# EasyEDA Pro project InOut Counter - Copy.eprj

# Schematic MainBoard
Board Name: PCB2; Create Date: 2026-01-17; Page Name: P1; Project Name: InOut Counter - Copy; Schematic Name: MainBoard; Update Date: 2026-01-24; Company: EasyEDA.com; Page Size: A4; Version: V1.0
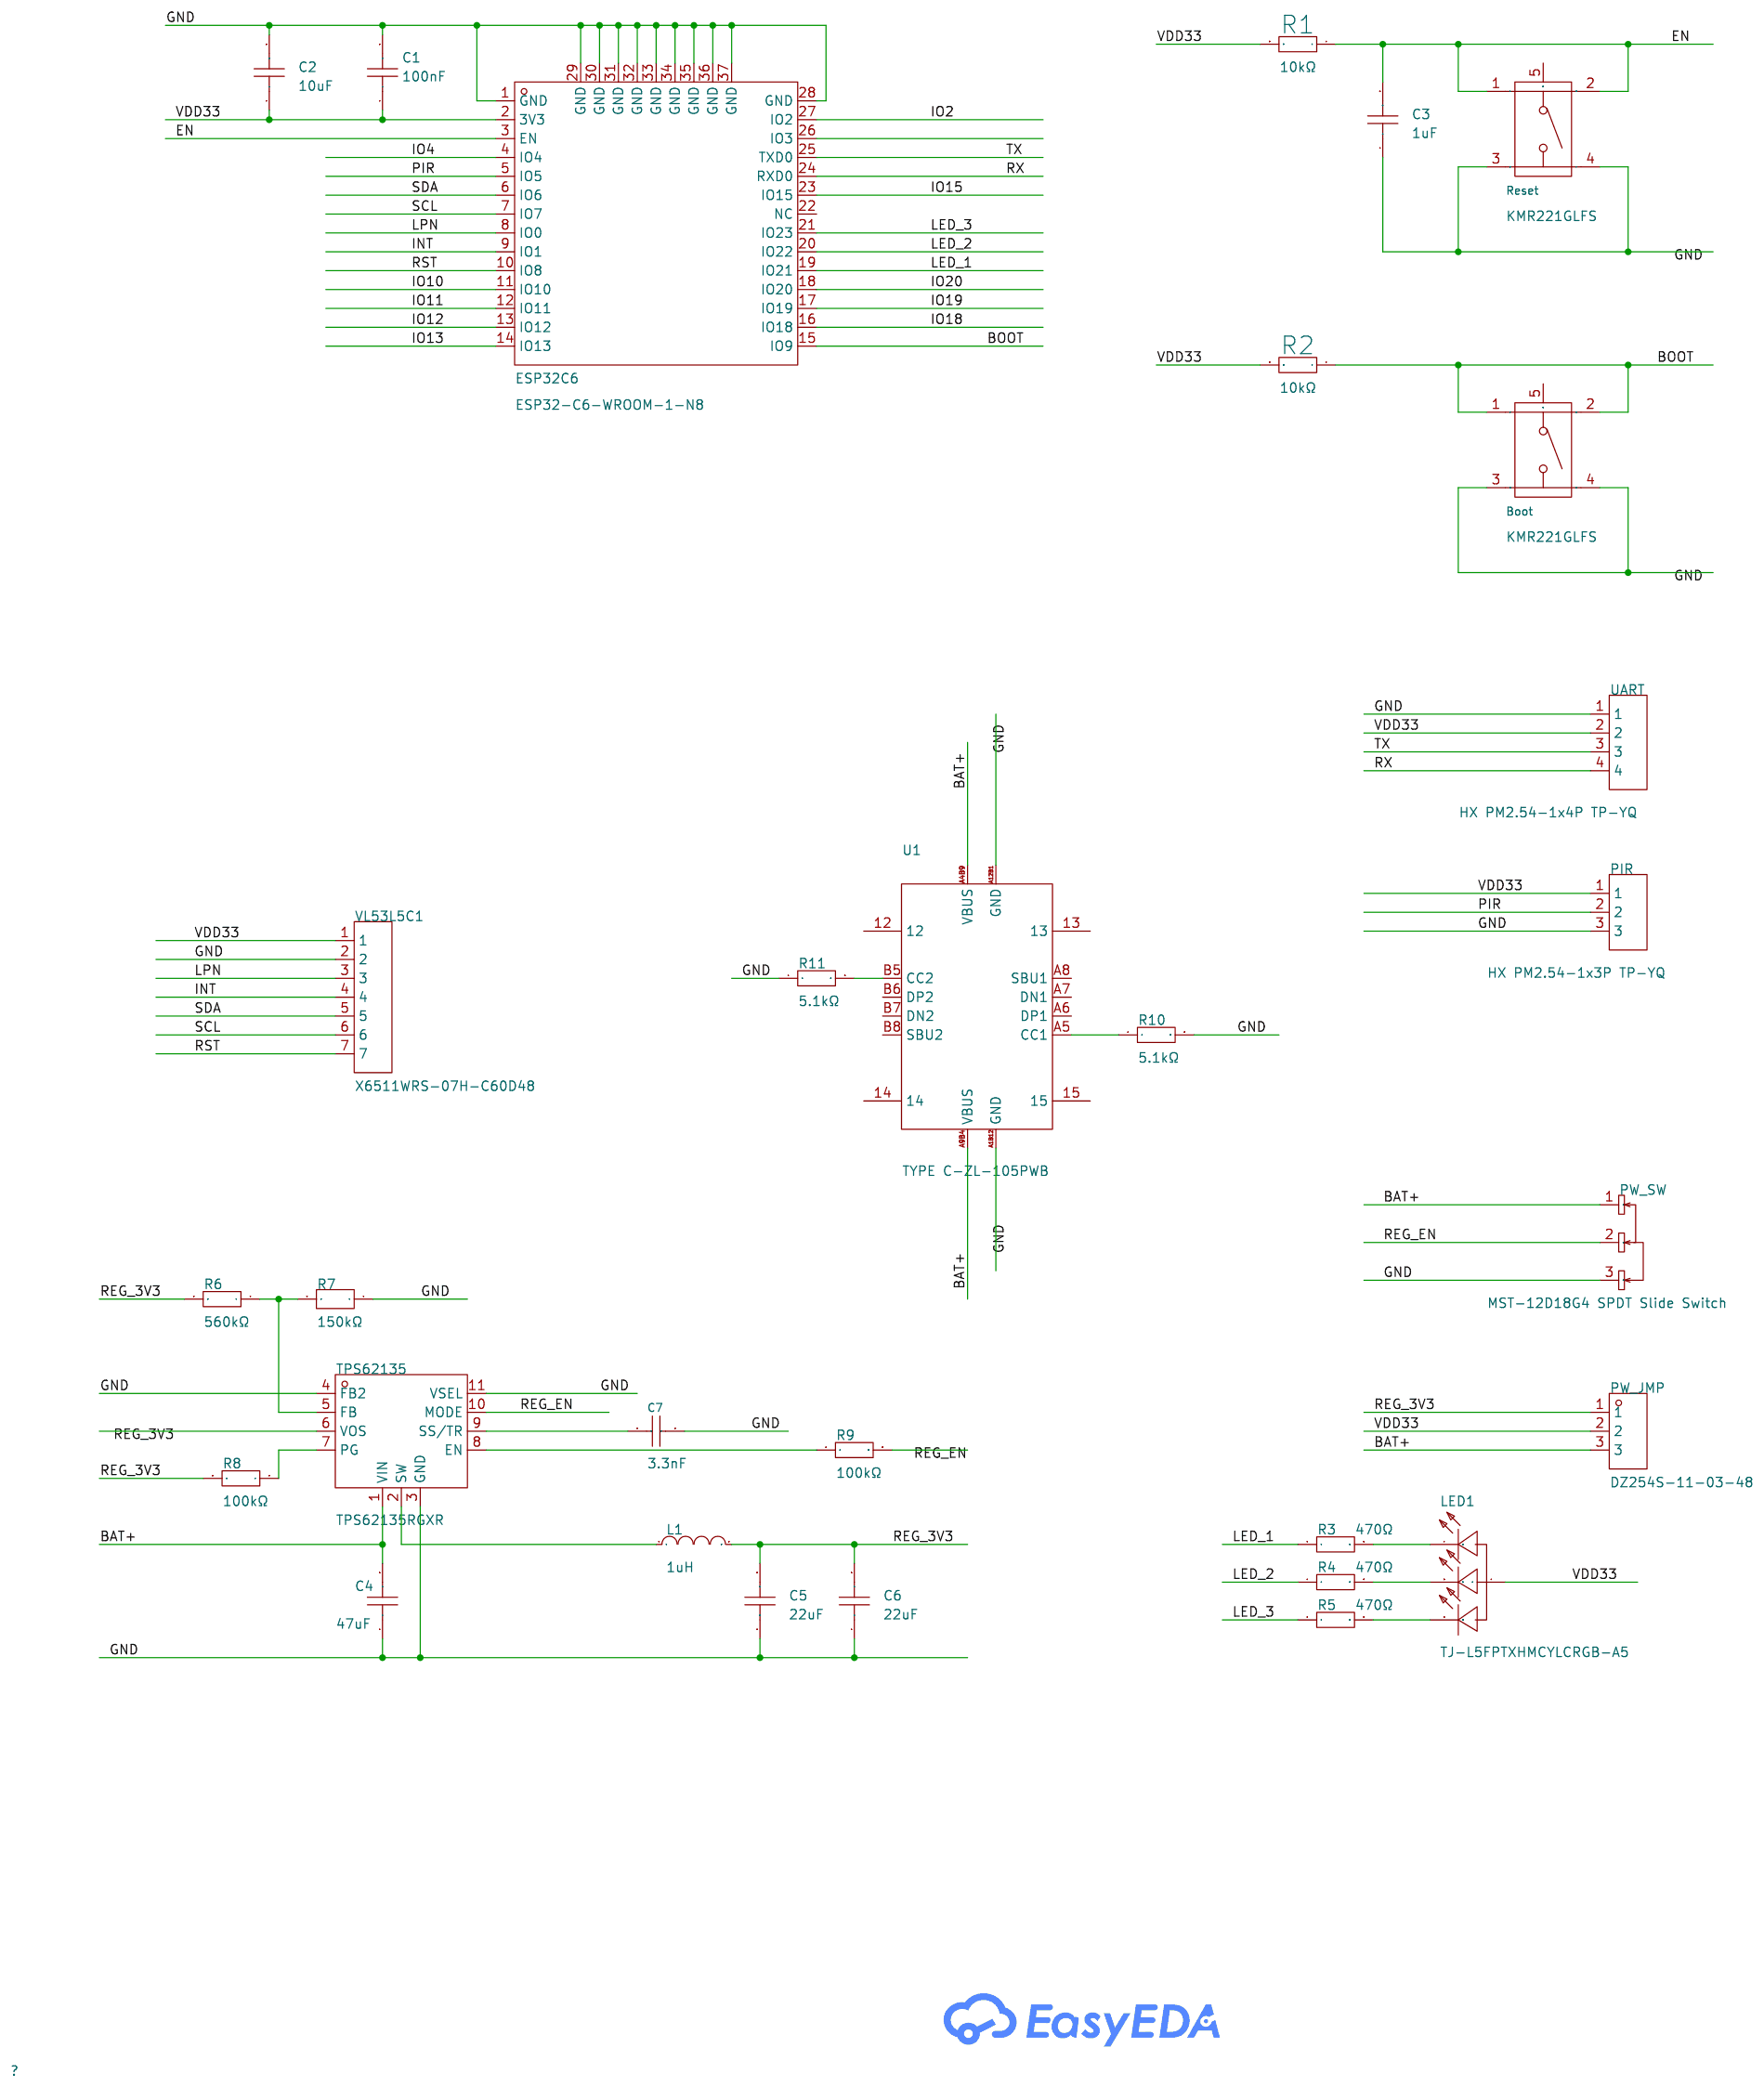
[diagram p0: schematic sheet]

## Parts
Boot  KMR221GLFS  [KEY-SMD_KMR2XXGXXX]
C1  100nF  [C0603]
C2  10uF  [C0603]
C3  1uF  [C0603]
C4  47uF  [C1206]
C5  22uF  [C0603]
C6  22uF  [C0603]
C7  3.3nF  [C0603]
ESP32C6  ESP32-C6-WROOM-1-N8  [WIRELM-SMD_ESP32-C6-WROOM-1]
L1  1uH  [IND-SMD_L2.5-W2.0-VLS252012CX-150M]
LED1  TJ-L5FPTXHMCYLCRGB-A5  [LED-TH_4P-BD5.8-P1.30]
PIR  HX PM2.54-1x3P TP-YQ  [HDR-SMD_3P-P2.54-V-F_C9900045551]
PW_JMP  DZ254S-11-03-48  [HDR-TH_3P-P2.54_DZ254S-11-03-48]
PW_SW  MST-12D18G4 SPDT Slide Switch  [SW-SMD_MST-12D18G4-SPDT-SLIDE-SWITCH]
R1  10kΩ  [R0603]
R2  10kΩ  [R0603]
R3  470Ω  [R0603]
R4  470Ω  [R0603]
R5  470Ω  [R0603]
R6  560kΩ  [R0603]
R7  150kΩ  [R0603]
R8  100kΩ  [R0603]
R9  100kΩ  [R0603]
R10  5.1kΩ  [R0603]
R11  5.1kΩ  [R0603]
Reset  KMR221GLFS  [KEY-SMD_KMR2XXGXXX]
TPS62135  TPS62135RGXR  [VQFN-HR-11_L3.0-W2.0-P0.50_TPS62135RGXR]
U1  TYPE C-ZL-105PWB  [TYPE-C-SMD_HDGC_TYPE-C-ZL-105PWB]
UART  HX PM2.54-1x4P TP-YQ  [HDR-SMD_HX-PM2.54-1X4P-TP-YQ]
VL53L5C1  X6511WRS-07H-C60D48  [HDR-SMD_7P-P2.54-H-M-W13.3-N]

## Library data of the parts
Boot Reset = KMR221GLFS: LCSC Part Name: 4.6*2.8*1.9mm 立贴 轻触开关; Supplier Part: C72443; Manufacturer: C&K; Supplier Footprint: SMD; JLCPCB Part Class: Extended Part; Datasheet: https://atta.szlcsc.com/upload/public/pdf/source/20181012/C265019_000848423B8E84768868498C37CC451B.pdf; Supplier: LCSC; Circuit: SPST; Actuator Style: Round Button; Operating Force: 200gf; Mounting Style: Brick nogging; Switch Length: 4.6mm; Switch Width: 2.8mm; Switch Height: 1.9mm; Contact Current: 50mA; Voltage Rating (DC): 32V; Pin Style: Gull Wing; Operating Temperature: -40℃~+85℃
C1 = TCC0603X7R104K500CT: LCSC Part Name: 100nF ±10% 50V; Supplier Part: C282519; Manufacturer: CCTC(三环); Supplier Footprint: 0603; JLCPCB Part Class: Extended Part; Datasheet: https://item.szlcsc.com/datasheet/TCC0603X7R104K500CT/268639.html; Supplier: LCSC; Tolerance: ±10%; Voltage Rating: 50V; Temperature Coefficient: X7R
C2 = CL10A106MQ8NNNC: LCSC Part Name: 10uF ±20% 6.3V; Supplier Part: C1691; Manufacturer: SAMSUNG(三星); Supplier Footprint: 0603; JLCPCB Part Class: Extended Part; Datasheet: https://item.szlcsc.com/datasheet/CL10A106MQ8NNNC/2043.html; Supplier: LCSC; Tolerance: ±20%; Voltage Rating: 6.3V; Temperature Coefficient: X5R
C3 = CGA0603X5R105K500JT: LCSC Part Name: 1uF ±10% 50V; Supplier Part: C6119852; Manufacturer: HRE(芯声); Supplier Footprint: 0603; JLCPCB Part Class: Extended Part; Datasheet: https://item.szlcsc.com/datasheet/CGA0603X5R105K500JT/7062558.html; Supplier: LCSC; Tolerance: ±10%; Voltage Rating: 50V; Temperature Coefficient: X5R
C4 = GRM31CR61E476ME44L: LCSC Part Name: 47uF ±20% 25V; Supplier Part: C403725; Manufacturer: muRata(村田); Supplier Footprint: 1206; JLCPCB Part Class: Extended Part; Datasheet: https://item.szlcsc.com/datasheet/GRM31CR61E476ME44L/389810.html; Supplier: LCSC; Tolerance: ±20%; Voltage Rating: 25V; Temperature Coefficient: X5R
C5 C6 = CL10A226MQ8NRNC: LCSC Part Name: 22uF ±20% 6.3V; Supplier Part: C59461; Manufacturer: SAMSUNG(三星); Supplier Footprint: 0603; JLCPCB Part Class: Basic Part; Datasheet: https://item.szlcsc.com/datasheet/CL10A226MQ8NRNC/60514.html; Supplier: LCSC; Tolerance: ±20%; Voltage Rating: 6.3V; Temperature Coefficient: X5R
C7 = CC0603KRX7R9BB332: LCSC Part Name: 3.3nF ±10% 50V; Supplier Part: C107088; Manufacturer: YAGEO(国巨); Supplier Footprint: 0603; JLCPCB Part Class: Extended Part; Datasheet: https://item.szlcsc.com/datasheet/CC0603KRX7R9BB332/108304.html; Supplier: LCSC; Tolerance: ±10%; Voltage Rating: 50V; Temperature Coefficient: X7R
ESP32C6 = ESP32-C6-WROOM-1-N8: Supplier Part: C5366877; Manufacturer: ESPRESSIF(乐鑫); JLCPCB Part Class: Extended Part; Datasheet: https://item.szlcsc.com/datasheet/ESP32-C6-WROOM-1-N8/6203223.html; Supplier: LCSC
L1 = VLS252012HBX-1R0M-1: LCSC Part Name: 1uH ±20% 3A; Supplier Part: C360732; Manufacturer: TDK; Supplier Footprint: 1008; JLCPCB Part Class: Extended Part; Datasheet: https://item.szlcsc.com/datasheet/VLS252012HBX-1R0M-1/335519.html; Supplier: LCSC; Tolerance: ±20%; Current Rating: 3A; Current - Saturation(Isat): 3A; DC Resistance(DCR): 47mΩ
LED1 = TJ-L5FPTXHMCYLCRGB-A5: Diode Configuration:Common Anode Wavelength - Dominant:B:460nm~470nm；G:515nm~530nm；R:620nm~630nm Peak Wavelength:R:620nm；G:520nm；B:465nm Luminous Intensity:R:100mcd~200mcd；B:100mcd~200mcd；G:400mcd~600mcd Lens Color:White Frosted Lens Forward Current:20mA; LCSC Part Name: 5MM平头共阳雾状RGB; Supplier Part: C20613339; Manufacturer: TOGIALED(统佳); Supplier Footprint: 插件; JLCPCB Part Class: Extended Part; Datasheet: https://item.szlcsc.com/datasheet/TJ-L5FPTXHMCYLCRGB-A5/21974274.html; Supplier: LCSC; Diode Configuration: Common Anode; Wavelength - Dominant: B:460nm~470nm；G:515nm~530nm；R:620nm~630nm; Peak Wavelength: R:620nm；G:520nm；B:465nm; Luminous Intensity: R:100mcd~200mcd；B:100mcd~200mcd；G:400mcd~600mcd; Lens Color: White Frosted Lens; Forward Current: 20mA; Forward Voltage(Vf): B:2.8V~3.6V；R:1.8V~2.6V；G:2.8V~3.6V; Power(Watts): 184mW; Operating Temperature: -20℃~+80℃; Lamp Holder Type: 5 mm flat-head LED; Pitch: 1.3mm
PIR = HX PM2.54-1x3P TP-YQ: LCSC Part Name: 1x3P 间距:2.54mm 立贴; Supplier Part: C42379196; Manufacturer: hanxia(韩下); Supplier Footprint: SMD,P=2.54mm(交错脚); JLCPCB Part Class: Extended Part; Datasheet: https://item.szlcsc.com/datasheet/HX%2520PM2.54-1x3P%2520TP-YQ/44285225.html; Supplier: LCSC; Holes Structure: 1x3P; Pitch: 2.54mm; Circular Hole / Square Hole: Square Hole; Mounting Type: Surface Mount,Vertical; Number of Rows: 1; Number of Positions: 3P; Current Rating: 3A; Voltage Rating (Max): 1kV; Holes Direction: Top; Insulation Height: 5mm; Contact Material: Brass; Contact Plating: Gold; Operating Temperature: -40℃~+105℃
PW_JMP = DZ254S-11-03-48: LCSC Part Name: 1x3P 间距:2.54mm 方针 立贴; Supplier Part: C5160786; Manufacturer: DEALON(德艺隆); Supplier Footprint: SMD,P=2.54mm(交错脚); JLCPCB Part Class: Extended Part; Datasheet: https://item.szlcsc.com/datasheet/DZ254S-11-03-48/5807882.html; Supplier: LCSC; Pin Structure: 1x3P; Pitch: 2.54mm; Circluar Pins/Square Pins: Pin Header; Mounting Type: Surface Mount,Vertical; Number of Rows: 1; Number of Pins: 3P; Current Rating: 3A; Length of Mating Pin: 6mm; Insulation Height: 2.54mm; Contact Material: Brass; Contact Plating: Gold; Color: Black
PW_SW = MST-12D18G4 SPDT Slide Switch: LCSC Part Name: MST-12D18G4卧式带柱编带; Supplier Part: C49023767; Manufacturer: SHOU HAN(首韩); Supplier Footprint: SMD; JLCPCB Part Class: Extended Part; Datasheet: https://item.szlcsc.com/datasheet/MST-12D18G4%2520SPDT%2520Slide%2520Switch/51384142.html; Supplier: LCSC; Circuit: SPDT; Actuator Style: Rectangular Columnar; Termination Style: SMD(SMT) Tab; Length: 9.1mm; Width: 3.5mm; Switch Height: 7.5mm; Mounting Type: Surface Mount, Right Angle; Actuator Color: Black; Current Rating: 100mA; Voltage Rating: 12V; Life: 10,000 Cycles; Operating Temperature: -25℃~+70℃
R1 R2 = 0603WAF1002T5E: LCSC Part Name: 厚膜电阻 10kΩ ±1% 100mW; Supplier Part: C25804; Manufacturer: UNI-ROYAL(厚声); Supplier Footprint: 0603; JLCPCB Part Class: Basic Part; Datasheet: https://item.szlcsc.com/datasheet/0603WAF1002T5E/26547.html; Supplier: LCSC; Type: Thick Film Resistor; Tolerance: ±1%; Power(Watts): 100mW; Voltage-Supply(Max): 75V; Temperature Coefficient: ±100ppm/℃; Operating Temperature: -55℃~+155℃
R3-R5 = 0603WAF4700T5E: LCSC Part Name: 470Ω ±1% 100mW 厚膜电阻; Supplier Part: C23179; Manufacturer: UNI-ROYAL(厚声); Supplier Footprint: 0603; JLCPCB Part Class: Basic Part; Datasheet: https://item.szlcsc.com/datasheet/0603WAF4700T5E/23906.html; Supplier: LCSC; Type: Thick Film Resistor; Tolerance: ±1%; Power(Watts): 100mW; Voltage-Supply(Max): 75V; Temperature Coefficient: ±100ppm/℃; Operating Temperature: -55℃~+155℃
R6 = 0603WAF5603T5E: LCSC Part Name: 560kΩ ±1% 100mW 厚膜电阻; Supplier Part: C23203; Manufacturer: UNI-ROYAL(厚声); Supplier Footprint: 0603; JLCPCB Part Class: Extended Part; Datasheet: https://item.szlcsc.com/datasheet/0603WAF5603T5E/23930.html; Supplier: LCSC; Type: Thick Film Resistor; Tolerance: ±1%; Power(Watts): 100mW; Voltage-Supply(Max): 75V; Temperature Coefficient: ±100ppm/℃; Operating Temperature: -55℃~+155℃
R7 = FRC0603F1503TS: LCSC Part Name: 150kΩ ±1% 100mW 厚膜电阻; Supplier Part: C2906993; Manufacturer: FOJAN(富捷); Supplier Footprint: 0603; JLCPCB Part Class: Extended Part; Supplier: LCSC; Type: Thick Film Resistor; Tolerance: ±1%; Power(Watts): 100mW; Voltage-Supply(Max): 75V; Temperature Coefficient: ±100ppm/℃; Operating Temperature: -55℃~+155℃
R8 R9 = 0603WAF1003T5E: LCSC Part Name: 100kΩ ±1% 100mW 厚膜电阻; Supplier Part: C25803; Manufacturer: UNI-ROYAL(厚声); Supplier Footprint: 0603; JLCPCB Part Class: Basic Part; Datasheet: https://item.szlcsc.com/datasheet/0603WAF1003T5E/26546.html; Supplier: LCSC; Type: Thick Film Resistor; Tolerance: ±1%; Power(Watts): 100mW; Voltage-Supply(Max): 75V; Temperature Coefficient: ±100ppm/℃; Operating Temperature: -55℃~+155℃
R10 R11 = 0603WAF5101T5E: LCSC Part Name: 5.1kΩ ±1% 100mW 厚膜电阻; Supplier Part: C23186; Manufacturer: UNI-ROYAL(厚声); Supplier Footprint: 0603; JLCPCB Part Class: Basic Part; Datasheet: https://item.szlcsc.com/datasheet/0603WAF5101T5E/23913.html; Supplier: LCSC; Type: Thick Film Resistor; Tolerance: ±1%; Power(Watts): 100mW; Voltage-Supply(Max): 75V; Temperature Coefficient: ±100ppm/℃; Operating Temperature: -55℃~+155℃
TPS62135 = TPS62135RGXR: LCSC Part Name: 高精度3V至17V 4A降压转换器; Supplier Part: C167238; Manufacturer: TI(德州仪器); Supplier Footprint: VQFN-11-HR(2x3); JLCPCB Part Class: Extended Part; Datasheet: https://www.ti.com/cn/lit/gpn/tps62135; Supplier: LCSC; Function: Step-down type; Output Type: Adjustable; Input Voltage: 3V~17V; Output Voltage: 800mV~12V; Output Current: 4A; Switching Frequency: 2.5MHz; Operating Temperature: -40℃~+125℃; Synchronous Rectification: Yes; Number of Outputs: 1; Topology: Step-down; Quiescent Current (Iq): 18uA; Switch tube (built-in/external): Built-in
U1 = TYPE C-ZL-105PWB: LCSC Part Name: Type-C 母 卧贴; Supplier Part: C5273953; Manufacturer: HDGC(华德共创); Supplier Footprint: SMD; JLCPCB Part Class: Extended Part; Datasheet: https://item.szlcsc.com/datasheet/TYPE%2520C-ZL-105PWB/6003804.html; Supplier: LCSC; Connector Type: Type-C; Gender: Female; Mounting Type: Surface Mount, Right Angle; Number of Contacts: 16P; Number of Ports: 1; Connect-Disconnect Life: 10,000 cycles; Length: 7.35mm
UART = HX PM2.54-1x4P TP-YQ: LCSC Part Name: 1x4P 间距:2.54mm 立贴; Supplier Part: C42379197; Manufacturer: hanxia(韩下); Supplier Footprint: SMD,P=2.54mm(交错脚); JLCPCB Part Class: Extended Part; Datasheet: https://item.szlcsc.com/datasheet/HX%2520PM2.54-1x4P%2520TP-YQ/44285226.html; Supplier: LCSC; Holes Structure: 1x4P; Pitch: 2.54mm; Circular Hole / Square Hole: Square Hole; Mounting Type: Surface Mount,Vertical; Number of Rows: 1; Number of Positions: 4P; Current Rating: 3A; Voltage Rating (Max): 1kV; Holes Direction: Top; Insulation Height: 5mm; Contact Material: Brass; Contact Plating: Gold; Operating Temperature: -40℃~+105℃
VL53L5C1 = X6511WRS-07H-C60D48: LCSC Part Name: 1x7P 间距:2.54mm 方针; Supplier Part: C5242200; Manufacturer: XKB Connection(中国星坤); Supplier Footprint: SMD,P=2.54mm; JLCPCB Part Class: Extended Part; Datasheet: https://atta.szlcsc.com/upload/public/pdf/source/20221103/EADF72CF36CD96D511D8188ACEE72315.pdf; Supplier: LCSC; Pin Structure: 1x7P; Pitch: 2.54mm; Row Spacing: 2.54mm; Circluar Pins/Square Pins: Policy; Number of Rows: Single Row; Number of Pins: 7P; Current Rating: 3A; Voltage Rating (Max): 250V; Insulation Height: 2.5mm; Contact Material: Brass; Contact Plating: Gold; Operating Temperature: -40℃~+105℃; Color: Black

## Nets
GND: Boot.3 Boot.4 C1.2 C2.2 C3.1 C4.1 C5.1 C6.1 C7.2 ESP32C6.1(GND) ESP32C6.28(GND) ESP32C6.29(GND) ESP32C6.30(GND) ESP32C6.31(GND) ESP32C6.32(GND) ESP32C6.33(GND) ESP32C6.34(GND) ESP32C6.35(GND) ESP32C6.36(GND) ESP32C6.37(GND) PIR.3 PW_SW.3 R7.1 R10.2 R11.1 Reset.3 Reset.4 TPS62135.3(GND) TPS62135.4(FB2) TPS62135.11(VSEL) U1.A1B12(GND) U1.A12B1(GND) UART.1 VL53L5C1.2
VDD33: C1.1 C2.1 ESP32C6.2(3V3) LED1.1 PIR.1 PW_JMP.2 R1.2 R2.2 UART.2 VL53L5C1.1
BAT+: C4.2 PW_JMP.3 PW_SW.1 TPS62135.1(VIN) U1.A4B9(VBUS) U1.A9B4(VBUS)
BOOT: Boot.1 Boot.2 ESP32C6.15(IO9) R2.1
EN: C3.2 ESP32C6.3(EN) R1.1 Reset.1 Reset.2
INT: ESP32C6.9(IO1) VL53L5C1.4
IO2: ESP32C6.27(IO2)
IO4: ESP32C6.4(IO4)
IO10: ESP32C6.11(IO10)
IO11: ESP32C6.12(IO11)
IO12: ESP32C6.13(IO12)
IO13: ESP32C6.14(IO13)
IO15: ESP32C6.23(IO15)
IO18: ESP32C6.16(IO18)
IO19: ESP32C6.17(IO19)
IO20: ESP32C6.18(IO20)
LED_1: ESP32C6.19(IO21) R3.1
LED_2: ESP32C6.20(IO22) R4.1
LED_3: ESP32C6.21(IO23) R5.1
LPN: ESP32C6.8(IO0) VL53L5C1.3
PIR: ESP32C6.5(IO5) PIR.2
REG_3V3: C5.2 C6.2 L1.2 PW_JMP.1 R6.2 R8.2 TPS62135.6(VOS)
REG_EN: PW_SW.2 R9.2 TPS62135.10(MODE)
RST: ESP32C6.10(IO8) VL53L5C1.7
RX: ESP32C6.24(RXD0) UART.4
SCL: ESP32C6.7(IO7) VL53L5C1.6
SDA: ESP32C6.6(IO6) VL53L5C1.5
TX: ESP32C6.25(TXD0) UART.3
$1N2759: L1.1 TPS62135.2(SW)
$1N2973: R8.1 TPS62135.7(PG)
$1N3037: R9.1 TPS62135.8(EN)
$1N3194: R6.1 R7.2 TPS62135.5(FB)
$1N3307: C7.1 TPS62135.9(SS/TR)
$1N5772: LED1.4(R) R3.2
$1N5776: LED1.3(G) R4.2
$1N5784: LED1.2(B) R5.2
$1N14396: R10.1 U1.A5(CC1)
$1N14407: R11.2 U1.B5(CC2)

Not connected (* = marked no-connect by the designer): Boot 5; ESP32C6 22(NC) 26(IO3); Reset 5; U1 12 13 14 15 A6(DP1) A7(DN1) A8(SBU1) B6(DP2) B7(DN2) B8(SBU2)

# Schematic DaughterBoard
Board Name: Board1; Create Date: 2026-01-23; Page Name: P1; Project Name: InOut Counter; Schematic Name: DaughterBoard; Update Date: 2026-01-23; Company: EasyEDA.com; Page Size: A4; Version: V1.0
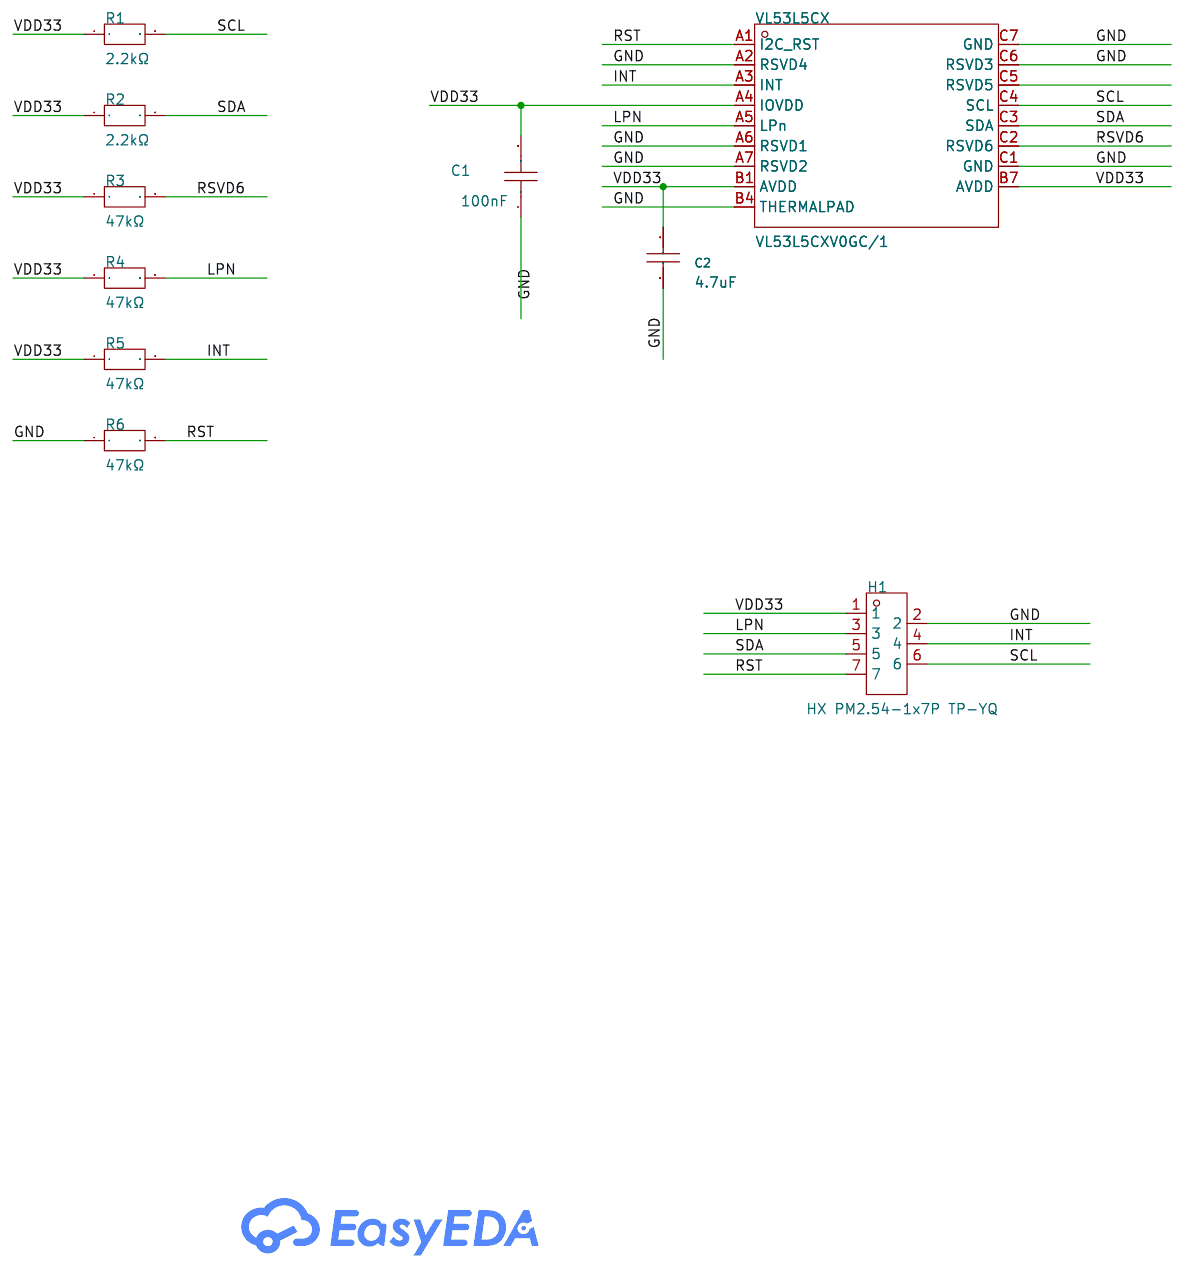
[diagram p1: schematic sheet]

## Parts
C1  100nF  [C0603]
C2  4.7uF  [C0603]
H1  HX PM2.54-1x7P TP-YQ  [HDR-SMD_7P-P2.54_HX-PM2.54-1X7P-TP-YQ]
R1  2.2kΩ  [R0603]
R2  2.2kΩ  [R0603]
R3  47kΩ  [R0603]
R4  47kΩ  [R0603]
R5  47kΩ  [R0603]
R6  47kΩ  [R0603]
VL53L5CX  VL53L5CXV0GC/1  [LGA-16_L6.4-W3.0_VL53L5CXV0GC-1]

## Library data of the parts
C1 = TCC0603X7R104K500CT: LCSC Part Name: 100nF ±10% 50V; Supplier Part: C282519; Manufacturer: CCTC(三环); Supplier Footprint: 0603; JLCPCB Part Class: Extended Part; Datasheet: https://item.szlcsc.com/datasheet/TCC0603X7R104K500CT/268639.html; Supplier: LCSC; Tolerance: ±10%; Voltage Rating: 50V; Temperature Coefficient: X7R
C2 = CL10A475KP8NNNC: LCSC Part Name: 4.7uF ±10% 10V; Supplier Part: C1705; Manufacturer: SAMSUNG(三星); Supplier Footprint: 0603; JLCPCB Part Class: Extended Part; Datasheet: https://item.szlcsc.com/datasheet/CL10A475KP8NNNC/2057.html; Supplier: LCSC; Tolerance: ±10%; Voltage Rating: 10V; Temperature Coefficient: X5R
H1 = HX PM2.54-1x7P TP-YQ: LCSC Part Name: 1x7P 间距:2.54mm 立贴; Supplier Part: C42379199; Manufacturer: hanxia(韩下); Supplier Footprint: SMD,P=2.54mm(交错脚); JLCPCB Part Class: Extended Part; Datasheet: https://item.szlcsc.com/datasheet/HX%2520PM2.54-1x7P%2520TP-YQ/44285228.html; Supplier: LCSC; Holes Structure: 1x7P; Pitch: 2.54mm; Circular Hole / Square Hole: Square Hole; Mounting Type: Surface Mount,Vertical; Number of Rows: 1; Number of Positions: 7P; Current Rating: 3A; Voltage Rating (Max): 1kV; Holes Direction: Top; Insulation Height: 5mm; Contact Material: Brass; Contact Plating: Gold; Operating Temperature: -40℃~+105℃
R1 R2 = FRC0603J222 TS: LCSC Part Name: 2.2kΩ ±5% 100mW 厚膜电阻; Supplier Part: C2907117; Manufacturer: FOJAN(富捷); Supplier Footprint: 0603; JLCPCB Part Class: Extended Part; Supplier: LCSC; Type: Thick Film Resistor; Tolerance: ±5%; Power(Watts): 100mW; Voltage-Supply(Max): 75V; Temperature Coefficient: ±100ppm/℃; Operating Temperature: -55℃~+155℃
R3-R6 = FRC0603F4702TS: LCSC Part Name: 47kΩ ±1% 100mW 厚膜电阻; Supplier Part: C2907042; Manufacturer: FOJAN(富捷); Supplier Footprint: 0603; JLCPCB Part Class: Extended Part; Supplier: LCSC; Type: Thick Film Resistor; Tolerance: ±1%; Power(Watts): 100mW; Voltage-Supply(Max): 75V; Temperature Coefficient: ±100ppm/℃; Operating Temperature: -55℃~+155℃
VL53L5CX = VL53L5CXV0GC/1: LCSC Part Name: I2C接口的飞行时间多区测距传感器; Supplier Part: C3178303; Manufacturer: ST(意法半导体); Supplier Footprint: SMD,6.4x3mm; JLCPCB Part Class: Extended Part; Datasheet: https://item.szlcsc.com/datasheet/VL53L5CXV0GC%252F1/3740241.html; Supplier: LCSC; Voltage - Supply: 2.8V~3.3V; Linear Range: 4m

## Nets
GND: C1.1 C2.1 H1.2 R6.1 VL53L5CX.A2(RSVD4) VL53L5CX.A6(RSVD1) VL53L5CX.A7(RSVD2) VL53L5CX.B4(THERMALPAD) VL53L5CX.C1(GND) VL53L5CX.C6(RSVD3) VL53L5CX.C7(GND)
VDD33: C1.2 C2.2 H1.1 R1.1 R2.1 R3.1 R4.1 R5.1 VL53L5CX.A4(IOVDD) VL53L5CX.B1(AVDD) VL53L5CX.B7(AVDD)
INT: H1.4 R5.2 VL53L5CX.A3(INT)
LPN: H1.3 R4.2 VL53L5CX.A5(LPn)
RST: H1.7 R6.2 VL53L5CX.A1(I2C_RST)
RSVD6: R3.2 VL53L5CX.C2(RSVD6)
SCL: H1.6 R1.2 VL53L5CX.C4(SCL)
SDA: H1.5 R2.2 VL53L5CX.C3(SDA)

Not connected (* = marked no-connect by the designer): VL53L5CX C5(RSVD5)

# Board PCB1
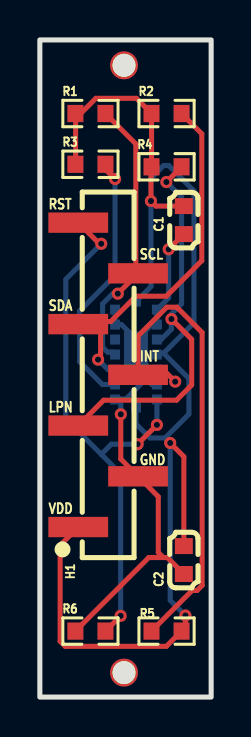
[diagram p2: board, top side]
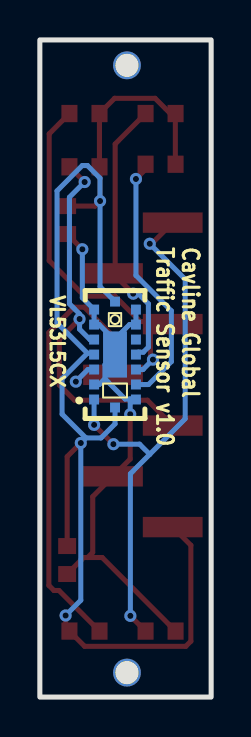
[diagram p3: board, bottom side, seen from below]

Outline 8.6 x 32.89 mm; copper layers: Top Layer, Bottom Layer. Coordinates in mm from the lower left corner of the outline.
Outline path: rectangle 0,32.89 8.6,0
Stack: Top Layer 0.035mm / Dielectric1 1.51mm FR4 er 4.5 / Bottom Layer 0.035mm

## Design rules (mm)
template: JLCPCB Capability(Two Layers Board)
spacing copperThickness1oz (default): track to track 0.102, other pairs 0.152 to 0.3
spacing copperThickness2oz: track to track 0.203, other pairs 0.152 to 0.3
track width copperThickness1oz (default): min 0.127, default 0.254, max 2.54
track width copperThickness2oz: min 0.203, default 0.254, max 2.54
differential pair differentialPair (default): width min 0.127, default 0.254, max 2.54; gap min 0.152, default 0.152
via viaSize (default): diameter min 0.5, default 0.61, max 10; hole min 0.3, default 0.305, max 6.3

## Placement (name value [footprint] x y rotation side)
C1  100nF  [C0603]  7.23 23.88 90 top
C2  4.7uF  [C0603]  7.23 6.86 90 top
H1  HX PM2.54-1x7P TP-YQ  [HDR-SMD_7P-P2.54_HX-PM2.54-1X7P-TP-YQ]  3.43 16.13 90 top
NOREF  -  [Pad_e801]  4.23 1.22 0 top
NOREF#2  -  [Pad_e800]  4.23 31.62 0 top
R1  2.2kΩ  [R0603]  2.54 29.21 0 top
R2  2.2kΩ  [R0603]  6.36 29.21 0 top
R3  47kΩ  [R0603]  2.54 26.67 0 top
R4  47kΩ  [R0603]  6.36 26.54 0 top
R5  47kΩ  [R0603]  6.36 3.3 180 top
R6  47kΩ  [R0603]  2.54 3.3 0 top
VL53L5CX  VL53L5CXV0GC/1  [LGA-16_L6.4-W3.0_VL53L5CXV0GC-1]  4.83 17.14 270 bottom

## Footprints (pads in the part's own frame, mm; a bottom-side part is the same pattern mirrored in y, then rotated)
C0603
  rect 0.8x0.9 smd: 1(-0.7,0) 2(0.7,0)
HDR-SMD_7P-P2.54_HX-PM2.54-1X7P-TP-YQ
  rect 1.02x3 smd: 1(-7.62,1.5) 2(-5.08,-1.5) 3(-2.54,1.5) 4(0,-1.5) 5(2.54,1.5) 6(5.08,-1.5) 7(7.62,1.5)
LGA-16_L6.4-W3.0_VL53L5CXV0GC-1
  rect 0.5x0.5 smd: A1(2.25,-1.05) A2(1.5,-1.05) A3(0.75,-1.05) A4(0,-1.05) A5(-0.75,-1.05) A6(-1.5,-1.05) A7(-2.25,-1.05) B1(2.65,0) B7(-2.65,0) C1(2.25,1.05) C2(1.5,1.05) C3(0.75,1.05) C4(0,1.05) C5(-0.75,1.05) C6(-1.5,1.05) C7(-2.25,1.05)
  rect 2.316x1.2 smd: B4(0,0)
Pad_e800
  round 1.4 hole 1.152: 1(0,0)
Pad_e801
  round 1.4 hole 1.152: 2(0,0)
R0603
  rect 0.806x0.864 smd: 1(-0.753,0) 2(0.753,0)

## Nets
As in the schematic.

Pads without a net: NOREF 2; NOREF#2 1

## Via types
v1: diameter 0.61, hole 0.305, Top Layer to Bottom Layer, 15 vias

## Routing (per net, layer and track width the routed paths; a pad name or vN(x,y) marks a point on that pad's centre or on a via; arc(x,y) is an arc through that point)
GND: length 29.5
  Top Layer w0.254: C2.1 6.4,6.98 6.2,6.98 ; C1.1 v1(6.47,22.41) ; 6.2,6.98 5.94,7.24 5.94,10.03 H1.2 4.06,11.91 v1(4.06,14.16) ; 6.2,6.98 5.47,6.98 R6.1
  Bottom Layer w0.254: 4.06,14.92 v1(4.06,14.16) ; 4.06,14.92 4.32,14.92 5.33,15.93 ; 4.06,14.92 3.8,14.92 VL53L5CX.C1 ; VL53L5CX.A2 5.62,15.64 5.33,15.93 ; 5.33,15.93 5.33,16.64 VL53L5CX.B4 4.86,17.18 4.86,17.88 ; VL53L5CX.C7 VL53L5CX.C6 4.1,18.64 4.86,17.88 ; 4.86,17.88 5.62,18.64 VL53L5CX.A6 VL53L5CX.A7 6.47,19.99 v1(6.47,22.41)
VDD33: length 67.8
  Top Layer w0.254: C2.2 7.23,12.03 v1(6.54,12.72) ; 1.8,29.21 1.8,26.68 R3.1 ; 1.8,29.21 R1.1 ; 1.8,29.21 2.05,29.21 2.81,29.97 4.85,29.97 R2.1 R4.1 5.58,26.51 v1(5.58,24.83) 5.83,24.58 C1.2 ; v1(7.31,4.08) 7.31,3.5 R5.1 6.35,2.54 1.27,2.54 1.02,2.79 1.02,7.6 H1.1
  Bottom Layer w0.254: VL53L5CX.A4 5.94,17.21 6.21,17.21 ; VL53L5CX.B7 5.58,20.55 v1(5.58,24.83) 5.58,25.97 6.21,26.61 6.47,26.61 7.74,25.34 7.74,18.73 6.21,17.21 ; 6.29,12.97 5.53,12.97 4.83,13.67 VL53L5CX.B1 ; 6.29,12.97 7.48,14.16 7.48,15.94 6.21,17.21 ; 6.29,12.97 v1(6.54,12.72) 6.54,4.84 v1(7.31,4.08)
INT: length 25.7
  Top Layer w0.254: 4.93,16.3 4.93,18.07 6.37,19.51 6.88,19.51 8.15,18.24 8.15,5.59 7.89,5.33 7.64,5.33 R5.2 ; 4.93,16.3 H1.4 ; 4.93,16.3 6.28,16.3 v1(6.79,15.79)
  Bottom Layer w0.254: VL53L5CX.A3 6.19,16.39 v1(6.79,15.79)
LPN: length 20.2
  Top Layer w0.254: v1(6.61,18.92) 7.62,17.91 7.62,15.62 6.86,14.86 3.2,14.86 H1.3 ; R4.2 v1(6.35,25.78)
  Bottom Layer w0.254: VL53L5CX.A5 6.09,17.89 6.61,18.42 6.61,19.18 7.11,19.69 7.11,25.02 v1(6.35,25.78)
RST: length 27.8
  Top Layer w0.254: R6.2 v1(4.06,4.06) ; H1.7 2.99,22.69 v1(3.08,22.69) ; v1(4.91,12.66) v1(5.88,13.62)
  Bottom Layer w0.254: 3.08,12.15 3.59,12.66 v1(4.91,12.66) ; 3.08,12.15 1.3,13.93 1.3,20.91 v1(3.08,22.69) ; 3.08,12.15 4.06,11.18 v1(4.06,4.06) ; v1(5.88,13.62) VL53L5CX.A1
RSVD6: length 13.1
  Top Layer w0.254: R3.2 3.29,26.42 v1(3.78,25.93)
  Bottom Layer w0.254: v1(3.78,25.93) 3.78,21.11 2,19.33 2,16.79 3.14,15.64 VL53L5CX.C2
SCL: length 14
  Top Layer w0.254: R1.2 4.82,27.69 4.82,21.32 H1.6 v1(3.91,20.19)
  Bottom Layer w0.254: VL53L5CX.C4 3.66,17.26 3.41,17.26 3.15,17.52 3.15,19.69 3.66,20.19 v1(3.91,20.19)
SDA: length 18.3
  Top Layer w0.254: R2.2 8.13,28.19 8.13,21.84 6.35,20.07 4.83,20.07 3.56,18.8 3.05,18.8 ; 3.05,18.8 2.06,18.8 H1.5 ; 3.05,18.8 3.05,17.02 v1(2.92,16.89)
  Bottom Layer w0.254: v1(2.92,16.89) 3.42,16.39 VL53L5CX.C3

## Text on the board
Bottom Silkscreen Layer: Cavline Global / Traffic Sensor v1.0
Top Silkscreen Layer: RST | SDA | LPN | VDD | SCL | INT | GND

# Board PCB2
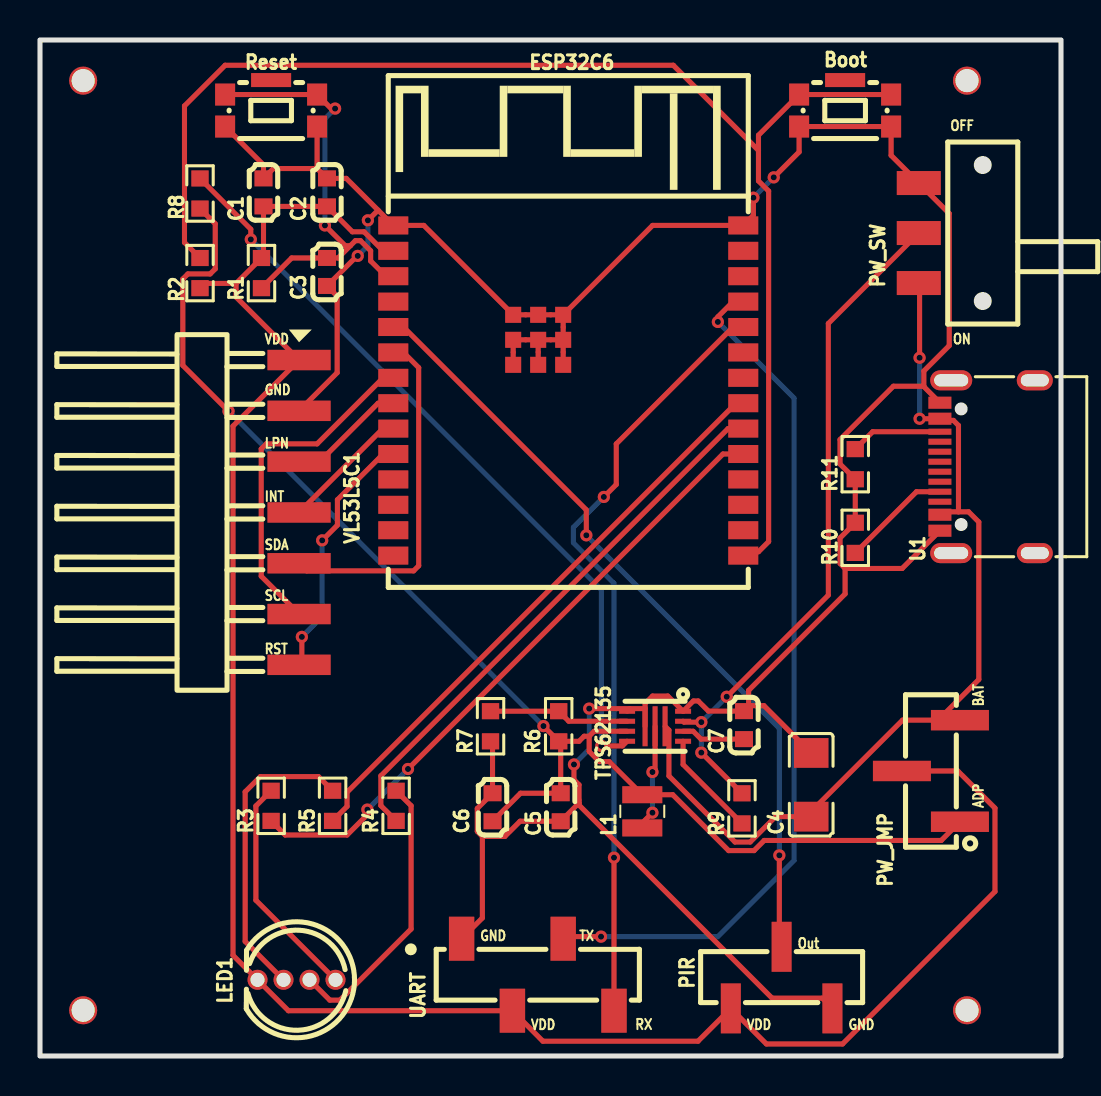
[diagram p4: board, top side]
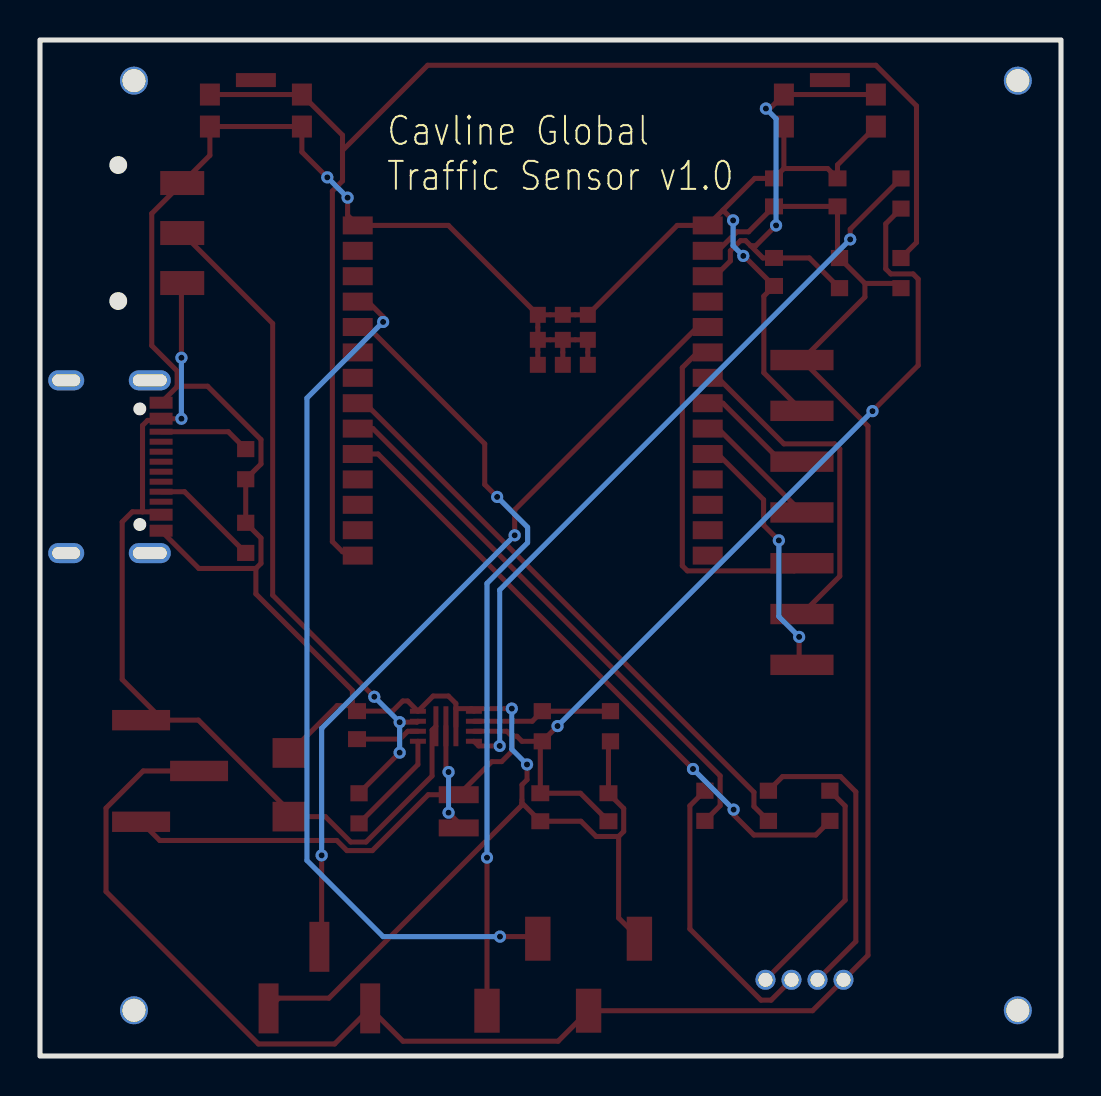
[diagram p5: board, bottom side, seen from below]

Outline 51.05 x 50.8 mm; copper layers: Top Layer, Bottom Layer. Coordinates in mm from the lower left corner of the outline.
Outline path: rectangle 0,50.8 51.05,0
Stack: Top Layer 0.035mm / Dielectric1 1.51mm FR4 er 4.5 / Bottom Layer 0.035mm

## Design rules (mm)
template: JLCPCB Capability(Two Layers Board)
spacing copperThickness1oz (default): track to track 0.102, other pairs 0.152 to 0.3
spacing copperThickness2oz: track to track 0.203, other pairs 0.152 to 0.3
track width copperThickness1oz (default): min 0.127, default 0.254, max 2.54
track width copperThickness2oz: min 0.203, default 0.254, max 2.54
differential pair differentialPair (default): width min 0.127, default 0.254, max 2.54; gap min 0.152, default 0.152
via viaSize (default): diameter min 0.5, default 0.61, max 10; hole min 0.3, default 0.305, max 6.3

## Placement (name value [footprint] x y rotation side)
Boot  KMR221GLFS  [KEY-SMD_KMR2XXGXXX]  40.26 47.63 0 top
C1  100nF  [C0603]  11.18 43.18 90 top
C2  10uF  [C0603]  14.35 43.18 90 top
C3  1uF  [C0603]  14.35 39.2 90 top
C4  47uF  [C1206]  38.56 13.56 270 top
C5  22uF  [C0603]  26.04 12.44 90 top
C6  22uF  [C0603]  22.63 12.44 270 top
C7  3.3nF  [C0603]  35.2 16.54 90 top
ESP32C6  ESP32-C6-WROOM-1-N8  [WIRELM-SMD_ESP32-C6-WROOM-1]  26.42 33.27 0 top
L1  1uH  [IND-SMD_L2.5-W2.0-VLS252012CX-150M]  30.12 12.23 90 top
LED1  TJ-L5FPTXHMCYLCRGB-A5  [LED-TH_4P-BD5.8-P1.30]  12.83 3.81 180 top
NOREF  -  [Pad_e35]  2.16 48.77 0 top
NOREF#2  -  [Pad_e31]  46.36 48.77 0 top
NOREF#3  -  [Pad_e36]  46.36 2.29 0 top
NOREF#4  -  [Pad_e37]  2.16 2.29 0 top
PIR  HX PM2.54-1x3P TP-YQ  [HDR-SMD_3P-P2.54-V-F_C9900045551]  37.08 3.92 0 top
PW_JMP  DZ254S-11-03-48  [HDR-TH_3P-P2.54_DZ254S-11-03-48]  44.55 14.25 90 top
PW_SW  MST-12D18G4 SPDT Slide Switch  [SW-SMD_MST-12D18G4-SPDT-SLIDE-SWITCH]  43.94 41.15 90 top
R1  10kΩ  [R0603]  11.08 39.15 90 top
R2  10kΩ  [R0603]  8 39.15 270 top
R3  470Ω  [R0603]  11.56 12.51 90 top
R4  470Ω  [R0603]  17.81 12.51 90 top
R5  470Ω  [R0603]  14.63 12.51 90 top
R6  560kΩ  [R0603]  25.94 16.49 270 top
R7  150kΩ  [R0603]  22.53 16.49 90 top
R8  100kΩ  [R0603]  8 43.12 270 top
R9  100kΩ  [R0603]  35.1 12.38 90 top
R10  5.1kΩ  [R0603]  40.77 25.91 90 top
R11  5.1kΩ  [R0603]  40.77 29.59 90 top
Reset  KMR221GLFS  [KEY-SMD_KMR2XXGXXX]  11.56 47.63 0 top
TPS62135  TPS62135RGXR  [VQFN-HR-11_L3.0-W2.0-P0.50_TPS62135RGXR]  30.76 16.49 90 top
U1  TYPE C-ZL-105PWB  [TYPE-C-SMD_HDGC_TYPE-C-ZL-105PWB]  47.37 29.46 90 top
UART  HX PM2.54-1x4P TP-YQ  [HDR-SMD_HX-PM2.54-1X4P-TP-YQ]  24.89 4.06 0 top
VL53L5C1  X6511WRS-07H-C60D48  [HDR-SMD_7P-P2.54-H-M-W13.3-N]  12.95 27.18 270 top

## Footprints (pads in the part's own frame, mm; a bottom-side part is the same pattern mirrored in y, then rotated)
C0603
  rect 0.8x0.9 smd: 1(-0.7,0) 2(0.7,0)
C1206
  rect 1.485x1.728 smd: 1(-1.593,0) 2(1.593,0)
HDR-SMD_3P-P2.54-V-F_C9900045551
  rect 1x2.5 smd: 1(-2.54,-1.54) 2(0,1.54) 3(2.54,-1.54)
HDR-SMD_7P-P2.54-H-M-W13.3-N
  rect 1.02x3.16 smd: 1(-7.62,0) 2(-5.08,0) 3(-2.54,0) 4(0,0) 5(2.54,0) 6(5.08,0) 7(7.62,0)
HDR-SMD_HX-PM2.54-1X4P-TP-YQ
  rect 1.27x2.2 smd: 1(-3.81,1.8) 2(-1.27,-1.8) 3(1.27,1.8) 4(3.81,-1.8)
HDR-TH_3P-P2.54_DZ254S-11-03-48
  rect 1.02x2.9 smd: 1(-2.54,-1.45) 2(0,1.45) 3(2.54,-1.45)
IND-SMD_L2.5-W2.0-VLS252012CX-150M
  rect 0.85x2 smd: 1(-0.83,0) 2(0.83,0)
KEY-SMD_KMR2XXGXXX
  rect 1x1.1 smd: 1(-2.3,0.438) 2(2.3,0.438) 3(-2.3,-1.162) 4(2.3,-1.162)
  rect 2x0.7 smd: 5(0,1.162)
LED-TH_4P-BD5.8-P1.30
  round 1 hole 0.7: 1(1.95,0) 2(0.65,0) 3(-0.65,0) 4(-1.95,0)
Pad_e31
  round 1.4 hole 1.152: 1(0,0)
Pad_e35
  round 1.4 hole 1.152: 2(0,0)
Pad_e36
  round 1.4 hole 1.152: 3(0,0)
Pad_e37
  round 1.4 hole 1.152: 4(0,0)
R0603
  rect 0.806x0.864 smd: 1(-0.753,0) 2(0.753,0)
SW-SMD_MST-12D18G4-SPDT-SLIDE-SWITCH
  rect 1.2x2.2 smd: 1(-2.5,0) 2(0,0) 3(2.5,0)
TYPE-C-SMD_HDGC_TYPE-C-ZL-105PWB
  oval 1x2.1 hole 0.6x1.7: 12(-4.32,1.808) 13(4.32,1.808)
  oval 1x1.8 hole 0.6x1.4: 14(-4.32,-2.373) 15(4.32,-2.373)
  rect 0.6x1.15 smd: A1B12(-3.2,2.373) A4B9(-2.4,2.373) A9B4(2.4,2.373) A12B1(3.2,2.373)
  rect 0.3x1.15 smd: A5(-1.25,2.373) A6(-0.25,2.373) A7(0.25,2.373) A8(1.25,2.373) B5(1.75,2.373) B6(0.75,2.373) B7(-0.75,2.373) B8(-1.75,2.373)
VQFN-HR-11_L3.0-W2.0-P0.50_TPS62135RGXR
  rect 2x0.25 smd: 1(0,-0.5) 2(0,0) 3(0,0.5)
  rect 0.25x0.8 smd: 4(0.75,1.4) 5(0.25,1.4) 6(-0.25,1.4) 7(-0.75,1.4) 8(-0.75,-1.4) 9(-0.25,-1.4) 10(0.25,-1.4) 11(0.75,-1.4)
WIRELM-SMD_ESP32-C6-WROOM-1
  rect 1.5x0.9 smd: 1(-8.75,8.255) 2(-8.75,6.985) 3(-8.75,5.715) 4(-8.75,4.445) 5(-8.75,3.175) 6(-8.75,1.905) 7(-8.75,0.635) 8(-8.75,-0.635) 9(-8.75,-1.905) 10(-8.75,-3.175) 11(-8.75,-4.445) 12(-8.75,-5.715) 13(-8.75,-6.985) 14(-8.75,-8.255) 15(8.75,-8.255) 16(8.75,-6.985) 17(8.75,-5.715) 18(8.75,-4.445) 19(8.75,-3.175) 20(8.75,-1.905) 21(8.75,-0.635) 22(8.75,0.635) 23(8.75,1.905) 24(8.75,3.175) 25(8.75,4.445) 26(8.75,5.715) 27(8.75,6.985) 28(8.75,8.255)
  rect 0.8x0.8 smd: 29(-2.755,3.785) 30(-1.505,3.785) 31(-0.255,3.785) 32(-0.255,2.535) 33(-1.505,2.535) 34(-2.755,2.535) 35(-2.755,1.285) 36(-1.505,1.285) 37(-0.255,1.285)

## Nets
As in the schematic.

Pads without a net: Boot 5; ESP32C6 22; NOREF 2; NOREF#2 1; NOREF#3 3; NOREF#4 4; Reset 5; U1 12 13 14 15 A6 A7 A8 B6 B7 B8

## Via types
v1: diameter 0.61, hole 0.305, Top Layer to Bottom Layer, 29 vias

## Routing (per net, layer and track width the routed paths; a pad name or vN(x,y) marks a point on that pad's centre or on a via; arc(x,y) is an arc through that point)
GND: length 160.4
  Top Layer w0.25: 26.95,12.8 26.95,13.56 26.7,13.81 v1(26.7,14.58) ; 30.26,17.37 TPS62135.3 ; 30.26,17.37 29.49,17.37 ; 30.26,17.37 30.26,17.62 30.63,18 31.39,18 TPS62135.11 32.67,17.75 32.92,17.75 33.42,17.24 C7.2 ; 29.49,17.37 v1(27.46,17.37) ; 29.49,17.37 TPS62135.4 ; 26.95,12.66 C5.1
  Top Layer w0.254: C4.1 36.2,17.52 35.43,17.52 ; 40.26,24.38 40.01,24.63 40.01,25.9 R10.2 R11.1 40.01,29.6 40.01,30.82 42.67,33.49 44.2,33.49 ; 40.26,24.38 40.26,23.11 35.43,18.28 35.43,17.52 ; 40.26,24.38 43.11,24.38 U1.A1B12 ; Reset.3 11.18,44.55 C1.2 11.67,44.37 13.86,44.37 ; ESP32C6.31 ESP32C6.32 ; ESP32C6.31 ESP32C6.30 ESP32C6.29 19.19,41.53 ESP32C6.1 16.9,42.29 ; ESP32C6.31 30.63,41.53 ESP32C6.28 35.67,42.04 v1(35.67,42.92) ; ESP32C6.33 ESP32C6.32 ; ESP32C6.33 ESP32C6.34 ESP32C6.35 ; ESP32C6.33 ESP32C6.36 ; R7.1 22.63,15.63 C6.1 21.87,12.38 21.87,11.23 22.12,10.98 ; 35.43,17.52 C7.2 ; 44.2,33.49 44.2,34.25 45.47,35.52 45.47,42.12 PW_SW.3 42.56,45.03 Boot.4 Boot.3 37.96,45.2 v1(36.69,43.93) ; 44.2,33.49 44.2,33.47 U1.A12B1 ; v1(15.89,40) 15.85,40 C3.1 14.86,37.99 14.86,34.16 VL53L5C1.2 ; 13.86,44.37 Reset.4 ; 13.86,44.37 C2.2 15.32,43.88 16.9,42.29 ; UART.1 22.12,6.9 22.12,10.98 ; ESP32C6.32 ESP32C6.37 ; C5.1 24.01,11.74 23.24,10.98 22.12,10.98 ; 16.9,42.29 v1(16.4,41.78) ; 39.62,2.38 39.11,2.89 36.61,2.89 26.95,12.54 26.95,12.8
  Bottom Layer w0.25: v1(26.7,14.58) 27.46,15.34 v1(27.46,17.37)
  Bottom Layer w0.254: v1(16.4,41.78) 16.4,40.51 v1(15.89,40) ; v1(36.69,43.93) v1(35.67,42.92)
VDD33: length 104
  Top Layer w0.254: 9.81,38.63 R1.2 11.18,40 C1.1 C2.1 15.62,41.21 16.21,41.21 17.16,40.26 ESP32C6.2 ; 9.81,38.63 8.24,38.63 R2.2 ; 9.81,38.63 9.81,37.95 VL53L5C1.1 9.65,31.5 9.65,5.03 LED1.1 12.42,2.26 UART.2 25.15,0.74 32.9,0.74 PIR.1 36.32,0.6 40.13,0.6 47.75,8.22 47.75,12.39 45.89,14.25 PW_JMP.2
BAT+: length 47.3
  Top Layer w0.25: TPS62135.1 31.45,16.29 31.45,14 34.75,10.7 35.51,10.7 36.78,11.97 C4.2
  Top Layer w0.254: U1.A4B9 45.14,27.21 45.93,27.21 ; v1(43.98,31.86) U1.A9B4 45.08,31.78 45.67,31.78 45.93,31.53 45.93,27.21 ; 45.93,27.21 46.44,27.21 46.94,26.7 46.94,18.83 44.91,16.79 ; C4.2 38.56,12.22 43.13,16.79 46,16.79 ; v1(43.98,34.91) 43.98,38.61 PW_SW.1
  Bottom Layer w0.254: v1(43.98,31.86) v1(43.98,34.91)
BOOT: length 68.8
  Top Layer w0.254: 35.93,45.28 31.67,49.54 9.26,49.54 7.23,47.5 7.23,40.67 R2.1 ; 35.93,45.28 35.93,43.75 36.44,43.25 36.44,25.72 35.93,25.21 35.36,25.21 ESP32C6.15 ; 35.93,45.28 35.93,46.04 Boot.1 Boot.2
EN: length 22.1
  Top Layer w0.254: 15.52,40.51 15.26,40.51 v1(14.25,41.53) ; 15.52,40.51 14.91,39.9 C3.2 12.58,39.9 R1.1 ; 15.52,40.51 15.77,40.77 16.03,40.77 16.53,40.26 16.53,39.75 17.3,38.99 ESP32C6.3 ; Reset.1 Reset.2 14.56,47.37 v1(14.76,47.37)
  Bottom Layer w0.254: v1(14.76,47.37) 14.25,46.86 v1(14.25,41.53)
INT: length 6.4
  Top Layer w0.254: ESP32C6.9 17.14,31.37 VL53L5C1.4
LED_1: length 31.9
  Top Layer w0.254: ESP32C6.19 34.15,30.1 v1(18.4,14.35) ; v1(16.37,12.32) 16.37,12.06 15.35,11.05 12.26,11.05 R3.1
  Bottom Layer w0.254: v1(18.4,14.35) v1(16.37,12.32)
LED_2: length 27.9
  Top Layer w0.254: R4.1 17.04,12.52 17.04,14.01 34.4,31.37 ESP32C6.20
LED_3: length 29.6
  Top Layer w0.254: R5.1 15.35,12.48 15.35,13.19 34.8,32.64 ESP32C6.21
LPN: length 5.9
  Top Layer w0.254: VL53L5C1.3 13.08,29.84 14.11,29.84 16.9,32.64 ESP32C6.8
PIR: length 39.3
  Top Layer w0.254: ESP32C6.5 18.17,36.45 27.32,27.31 v1(27.32,26.03) ; v1(36.97,10.03) 36.97,5.57 PIR.2
  Bottom Layer w0.254: v1(27.32,26.03) 36.97,16.38 v1(36.97,10.03)
REG_3V3: length 68.3
  Top Layer w0.25: 27.46,15.99 27.46,15.23 27.97,14.72 28.46,14.72 L1.2 ; 27.46,15.99 27.21,15.99 26.95,15.73 R6.2 ; 27.46,15.99 27.71,16.24 TPS62135.6
  Top Layer w0.254: v1(9.43,32.24) 7.14,34.53 7.14,38.85 7.39,39.1 8.51,39.1 8.76,39.36 8.76,41.61 R8.2 ; L1.2 31.64,13.06 34.43,10.27 35.7,10.27 36.21,10.78 45.07,10.78 PW_JMP.1 ; C6.2 24.03,13.14 C5.2 26.04,15.63 R6.2 v1(25.17,16.5)
  Bottom Layer w0.254: v1(25.17,16.5) v1(9.43,32.24)
REG_EN: length 34.3
  Top Layer w0.25: PW_SW.2 39.42,36.62 39.42,23.04 v1(34.34,17.96) ; TPS62135.10 32.2,16.69 v1(33.07,16.69) ; R9.2 v1(33.07,15.17)
  Bottom Layer w0.25: v1(34.34,17.96) v1(33.07,16.69) v1(33.07,15.17)
RST: length 12.8
  Top Layer w0.254: v1(13.09,20.95) 13.09,19.7 VL53L5C1.7 ; ESP32C6.10 17.16,30.1 14.87,27.81 14.87,26.54 v1(14.11,25.78)
  Bottom Layer w0.254: v1(14.11,25.78) 14.11,21.97 v1(13.09,20.95)
RX: length 38.8
  Top Layer w0.254: v1(28.19,27.95) 28.82,28.58 28.82,30.61 34.66,36.45 ESP32C6.24 ; v1(28.7,9.92) UART.4
  Bottom Layer w0.254: v1(28.19,27.95) 26.67,26.43 26.67,25.67 28.7,23.64 v1(28.7,9.92)
SCL: length 17.1
  Top Layer w0.254: VL53L5C1.6 11.06,23.99 11.06,30.35 11.32,30.61 13.86,30.61 17.16,33.91 ESP32C6.7
SDA: length 17.7
  Top Layer w0.254: ESP32C6.6 18.17,35.18 18.94,34.42 18.94,24.51 18.68,24.26 13.33,24.26 VL53L5C1.5
TX: length 43.5
  Top Layer w0.254: v1(33.9,36.7) 33.9,36.96 34.66,37.72 35.17,37.72 ; 26.16,5.86 26.27,5.97 v1(28.05,5.97)
  Bottom Layer w0.254: v1(33.9,36.7) 37.71,32.89 37.71,9.78 33.9,5.97 v1(28.05,5.97)
$1N2759: length 5.3
  Top Layer w0.25: L1.1 30.12,11.66 v1(30.62,12.17) ; TPS62135.2 30.76,14.33 v1(30.62,14.2)
  Bottom Layer w0.25: v1(30.62,12.17) v1(30.62,14.2)
$1N2973: length 38.1
  Top Layer w0.25: v1(10.54,40.83) 10.54,41.34 R8.1 ; TPS62135.7 29.12,15.5 v1(28.07,15.5)
  Bottom Layer w0.25: v1(28.07,15.5) 28.07,23.3 v1(10.54,40.83)
$1N3037: length 5.3
  Top Layer w0.25: TPS62135.8 32.16,14.57 R9.1
$1N3194: length 7
  Top Layer w0.25: R6.1 26.44,16.74 TPS62135.5
  Top Layer w0.254: R6.1 R7.2
$1N3307: length 3.2
  Top Layer w0.25: TPS62135.9 32.66,16.24 33.06,15.84 C7.1
$1N5772: length 11.4
  Top Layer w0.254: R3.2 10.8,12.5 10.8,7.79 LED1.4
$1N5776: length 14.2
  Top Layer w0.254: LED1.3 14.49,2.79 15,2.79 18.56,6.35 18.56,12.51 R4.2
$1N5784: length 15.2
  Top Layer w0.254: LED1.2 10.26,5.73 10.26,13.21 11.02,13.97 13.92,13.97 R5.2
$1N14396: length 5.5
  Top Layer w0.254: U1.A5 43.83,28.21 R10.1
$1N14407: length 4.6
  Top Layer w0.254: R11.2 41.64,31.21 U1.B5

## Text on the board
Bottom Silkscreen Layer: Cavline Global / Traffic Sensor v1.0
Top Silkscreen Layer: VDD | GND | LPN | INT | SDA | SCL | RST | TX | Out | OFF | ON | BAT | ADP | RX
